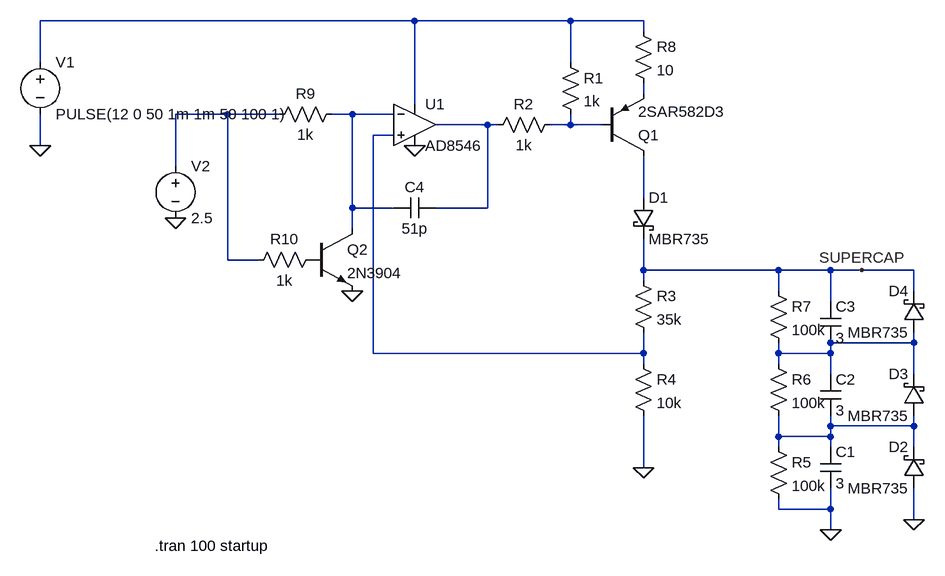
[diagram p0: schematic SuperCap_Charger.asc]
SuperCap_Charger.asc, the LTspice schematic file:
Version 4
SHEET 1 900 824
WIRE 80 0 -496 0
WIRE 320 0 80 0
WIRE 432 0 320 0
WIRE 432 16 432 0
WIRE -496 64 -496 0
WIRE 320 64 320 0
WIRE 432 112 432 96
WIRE 80 128 80 0
WIRE -208 144 -288 144
WIRE -128 144 -208 144
WIRE -16 144 -48 144
WIRE 48 144 -16 144
WIRE 192 160 112 160
WIRE 208 160 192 160
WIRE 320 160 320 144
WIRE 320 160 288 160
WIRE 368 160 320 160
WIRE 48 176 16 176
WIRE -496 192 -496 144
WIRE -288 224 -288 144
WIRE 432 272 432 208
WIRE -16 288 -16 144
WIRE 48 288 -16 288
WIRE 192 288 192 160
WIRE 192 288 112 288
WIRE -16 320 -16 288
WIRE -208 368 -208 144
WIRE -160 368 -208 368
WIRE 432 384 432 336
WIRE 640 384 432 384
WIRE 720 384 640 384
WIRE 768 384 720 384
WIRE 848 384 768 384
WIRE 432 400 432 384
WIRE 640 416 640 384
WIRE 848 416 848 384
WIRE 720 432 720 384
WIRE 848 496 848 480
WIRE 848 496 720 496
WIRE 16 512 16 176
WIRE 432 512 432 480
WIRE 432 512 16 512
WIRE 640 512 640 496
WIRE 720 512 720 496
WIRE 720 512 640 512
WIRE 432 528 432 512
WIRE 640 528 640 512
WIRE 720 544 720 512
WIRE 848 544 848 496
WIRE 720 624 720 608
WIRE 848 624 848 608
WIRE 848 624 720 624
WIRE 640 640 640 608
WIRE 720 640 720 624
WIRE 720 640 640 640
WIRE 640 656 640 640
WIRE 720 656 720 640
WIRE 848 656 848 624
WIRE 432 688 432 608
WIRE 640 752 640 736
WIRE 720 752 720 720
WIRE 720 752 640 752
WIRE 848 768 848 720
WIRE 720 784 720 752
FLAG 80 192 0
FLAG 768 384 SUPERCAP
FLAG 720 784 0
FLAG 848 768 0
FLAG -496 192 0
FLAG -288 304 0
FLAG 432 688 0
FLAG -16 416 0
SYMBOL Opamps\\AD8546 80 96 R0
SYMATTR InstName U1
SYMBOL pnp 368 208 M180
SYMATTR InstName Q1
SYMATTR Value 2SAR582D3
SYMBOL voltage -496 48 R0
WINDOW 123 0 0 Left 0
WINDOW 39 0 0 Left 0
SYMATTR InstName V1
SYMATTR Value PULSE(12 0 50 1m 1m 50 100 1)
SYMBOL voltage -288 208 R0
SYMATTR InstName V2
SYMATTR Value 2.5
SYMBOL res 304 48 R0
SYMATTR InstName R1
SYMATTR Value 1k
SYMBOL res 304 144 R90
WINDOW 0 0 56 VBottom 2
WINDOW 3 32 56 VTop 2
SYMATTR InstName R2
SYMATTR Value 1k
SYMBOL res 416 384 R0
SYMATTR InstName R3
SYMATTR Value 35k
SYMBOL res 416 512 R0
SYMATTR InstName R4
SYMATTR Value 10k
SYMBOL cap 704 656 R0
SYMATTR InstName C1
SYMATTR Value 3
SYMBOL cap 704 544 R0
SYMATTR InstName C2
SYMATTR Value 3
SYMBOL cap 704 432 R0
SYMATTR InstName C3
SYMATTR Value 3
SYMBOL res 624 640 R0
SYMATTR InstName R5
SYMATTR Value 100k
SYMBOL res 624 512 R0
SYMATTR InstName R6
SYMATTR Value 100k
SYMBOL res 624 400 R0
SYMATTR InstName R7
SYMATTR Value 100k
SYMBOL schottky 864 720 R180
WINDOW 0 24 64 Left 2
WINDOW 3 24 0 Left 2
SYMATTR InstName D2
SYMATTR Value MBR735
SYMBOL schottky 864 608 R180
WINDOW 0 24 64 Left 2
WINDOW 3 24 0 Left 2
SYMATTR InstName D3
SYMATTR Value MBR735
SYMBOL schottky 864 480 R180
WINDOW 0 24 64 Left 2
WINDOW 3 24 0 Left 2
SYMATTR InstName D4
SYMATTR Value MBR735
SYMBOL schottky 416 272 R0
SYMATTR InstName D1
SYMATTR Value MBR735
SYMBOL res 416 0 R0
SYMATTR InstName R8
SYMATTR Value 10
SYMBOL res -32 128 R90
WINDOW 0 0 56 VBottom 2
WINDOW 3 32 56 VTop 2
SYMATTR InstName R9
SYMATTR Value 1k
SYMBOL cap 112 272 R90
WINDOW 0 0 32 VBottom 2
WINDOW 3 32 32 VTop 2
SYMATTR InstName C4
SYMATTR Value 51p
SYMBOL npn -80 320 R0
SYMATTR InstName Q2
SYMATTR Value 2N3904
SYMBOL res -64 352 R90
WINDOW 0 0 56 VBottom 2
WINDOW 3 32 56 VTop 2
SYMATTR InstName R10
SYMATTR Value 1k
TEXT -320 808 Left 2 !.tran 100 startup

The netlist it stands for:
* SuperCap_Charger.asc
XU1 N007 N004 N001 0 N005 AD8546  ; pins In+ In- V+ V- OUT
Q1 N008 N006 N002 0 2SAR582D3
V1 N001 0 PULSE(12 0 50 1m 1m 50 100 1)
V2 N003 0 2.5
R1 N001 N006 1k
R2 N006 N005 1k
R3 SUPERCAP N007 35k
R4 N007 0 10k
C1 N010 0 3
C2 N009 N010 3
C3 SUPERCAP N009 3
R5 N010 0 100k
R6 N009 N010 100k
R7 SUPERCAP N009 100k
D2 0 N010 MBR735
D3 N010 N009 MBR735
D4 N009 SUPERCAP MBR735
D1 N008 SUPERCAP MBR735
R8 N001 N002 10
R9 N004 N003 1k
C4 N005 N004 51p
Q2 N004 P001 0 0 2N3904
R10 P001 N003 1k
.model D D
.lib standard.dio
.model NPN NPN
.model PNP PNP
.lib standard.bjt
.tran 100 startup
.backanno
.end